# Altium project F030K6.PrjPcb
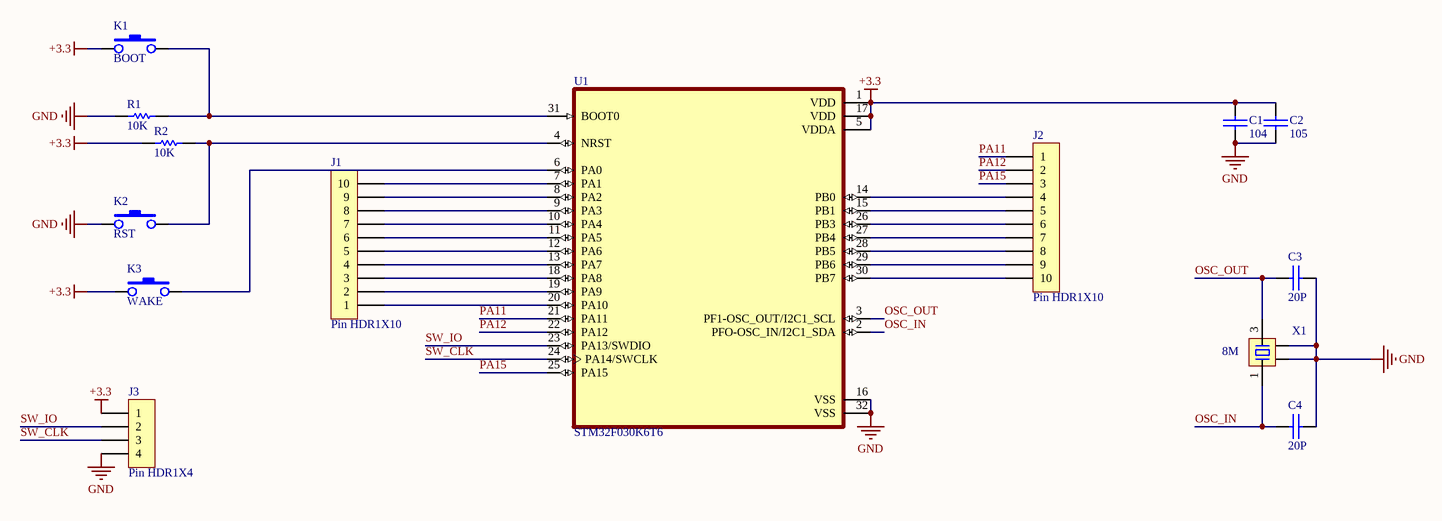
[diagram p0: K6.SchDoc]
1 sheet, 14 parts. Net scope: global (net labels, ports and power ports of the same name join across sheets).
Board file: PCB.PcbDoc

## Sheet K6.SchDoc
size A4; SheetNumber: 1; SheetTotal: 1

### Parts
C1  104  [0805C]
C2  105  [0805C]
C3  20P  [0805C]
C4  20P  [0805C]
J1  Pin HDR1X10  [Pin HDR1X10/2.54mm-S]
J2  Pin HDR1X10  [Pin HDR1X10/2.54mm-S]
J3  Pin HDR1X4  [Pin HDR1X4/2.54mm-S]
K1  BOOT  [SW-SMD_L3.9-W2.9-P4.15-LS5.0]
K2  RST  [SW-SMD_L3.9-W2.9-P4.15-LS5.0]
K3  WAKE  [SW-SMD_L3.9-W2.9-P4.15-LS5.0]
R1  10K  [0805R]
R2  10K  [0805R]
U1  STM32F030K6T6  [LQFP32 7X7]
X1  8M  [OSC 5032-4P]

### Nets
+3.3: C1.2 C2.2 J3.1 K1.1 K3.1 R2.1 U1.1(VDD) U1.5(VDDA) U1.17(VDD)
GND: C1.1 C2.1 C3.2 C4.2 J3.4 K2.1 R1.1 U1.16(VSS) U1.32(VSS) X1.2 X1.4
OSC_IN: C4.1 U1.2(PFO-OSC_IN/I2C1_SDA) X1.1
OSC_OUT: C3.1 U1.3(PF1-OSC_OUT/I2C1_SCL) X1.3
PA11: J2.1 U1.21(PA11)
PA12: J2.2 U1.22(PA12)
PA15: J2.3 U1.25(PA15)
SW_CLK: J3.3 U1.24(PA14/SWCLK)
SW_IO: J3.2 U1.23(PA13/SWDIO)
NetJ1_1: J1.1 U1.20(PA10)
NetJ1_2: J1.2 U1.19(PA9)
NetJ1_3: J1.3 U1.18(PA8)
NetJ1_4: J1.4 U1.13(PA7)
NetJ1_5: J1.5 U1.12(PA6)
NetJ1_6: J1.6 U1.11(PA5)
NetJ1_7: J1.7 U1.10(PA4)
NetJ1_8: J1.8 U1.9(PA3)
NetJ1_9: J1.9 U1.8(PA2)
NetJ1_10: J1.10 U1.7(PA1)
NetJ2_4: J2.4 U1.14(PB0)
NetJ2_5: J2.5 U1.15(PB1)
NetJ2_6: J2.6 U1.26(PB3)
NetJ2_7: J2.7 U1.27(PB4)
NetJ2_8: J2.8 U1.28(PB5)
NetJ2_9: J2.9 U1.29(PB6)
NetJ2_10: J2.10 U1.30(PB7)
NetK1_3: K1.3 R1.2 U1.31(BOOT0)
NetK2_3: K2.3 R2.2 U1.4(NRST)
NetK3_3: K3.3 U1.6(PA0)

### Library data of the parts
C1-C4 = CAP: 无极性电容
K1-K3 = KEY
R1 R2 = RES
U1 = STM32F030K6T6: MF: {'manufacturer': u'STMicroelectronics'}; Price: None; Value: *; Package: None; Availability: Unavailable; MP: STM32F030K6T6
X1 = XTAL-4P: 4脚无源晶振